# EAGLE schematic smps (EAGLE 7.3.0)
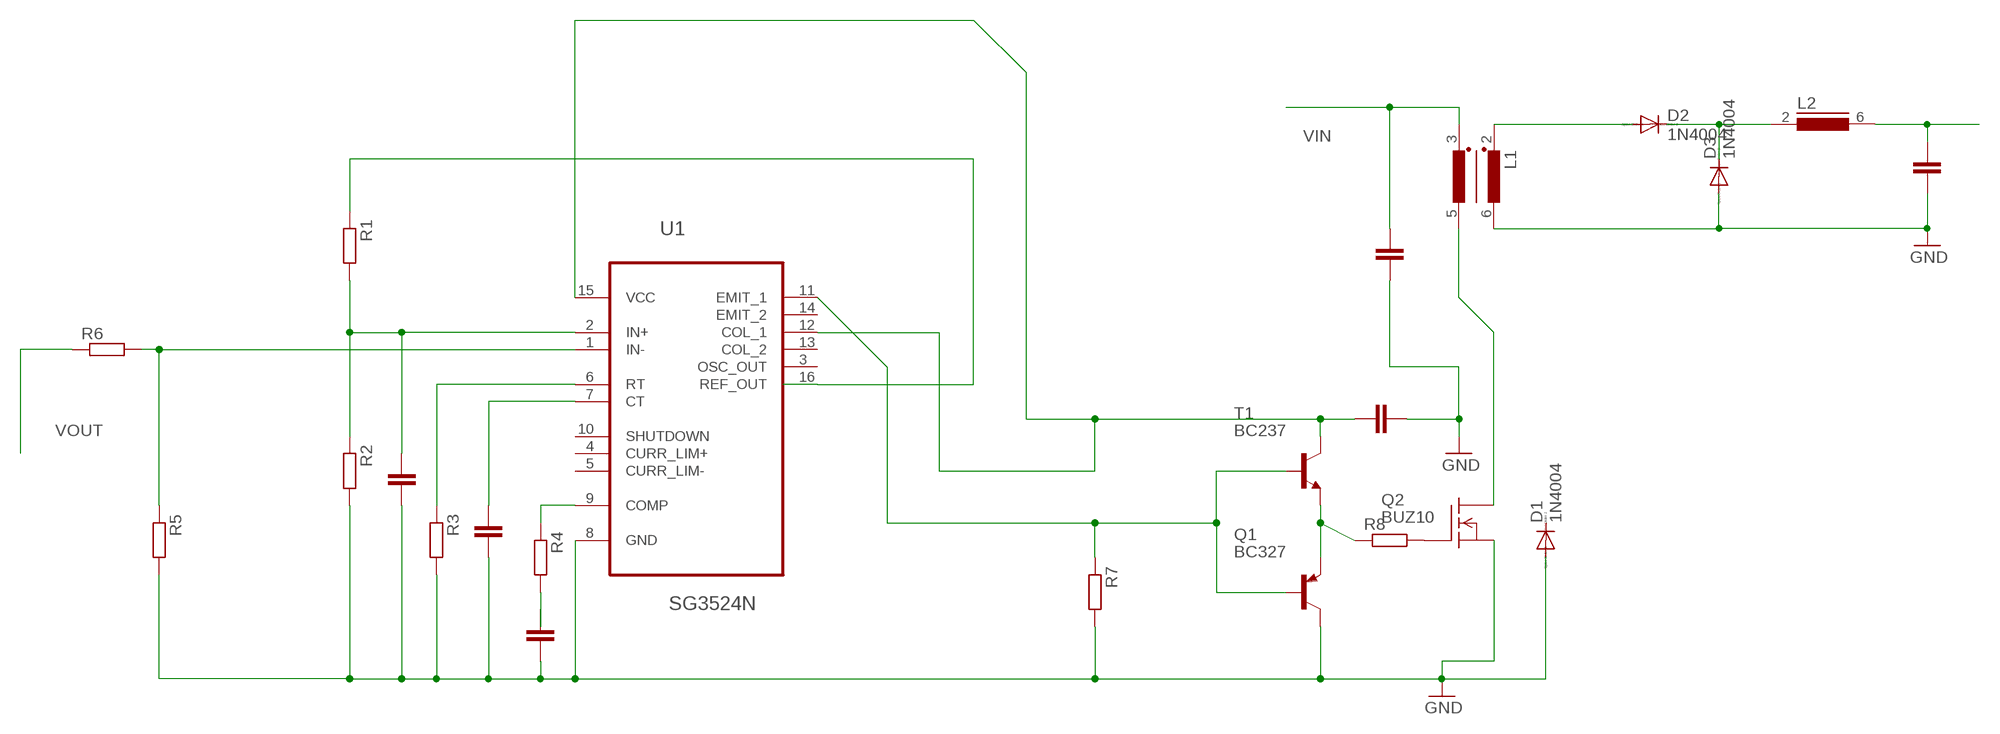
[diagram p0: schematic, sheet 1]

## Parts
D1  1N4004  [DO41-10]
D2  1N4004  [DO41-10]
D3  1N4004  [DO41-10]
L1  RM6-2  [RM5-4]
L2  RM6  [RM6-4]
Q1  BC327  [TO92]
Q2  BUZ10  [TO220]
R1  R-EU_0204/7  [0204/7]
R2  R-EU_0204/7  [0204/7]
R3  R-EU_0204/7  [0204/7]
R4  R-EU_0204/7  [0204/7]
R5  R-EU_0204/7  [0204/7]
R6  R-EU_0204/7  [0204/7]
R7  R-EU_0204/7  [0204/7]
R8  R-EU_0204/7  [0204/7]
T1  BC237  [TO92]
U1  SG3524N  [DIP254P762X508-16]

## Nets
GND: D1.A D3.A L1.6(W1E) Q1.3(C) Q2.3(S) R2.2 R3.2 R5.2 R7.2 U1.8(GND)
N$1: R1.1 U1.16(REF_OUT)
N$2: R1.2 R2.1 U1.2(IN+)
N$3: Q1.2(B) R7.1 T1.2(B) U1.11(EMIT_1)
N$4: T1.3(C) U1.12(COL_1) U1.15(VCC)
N$5: R3.1 U1.6(RT)
N$6: U1.7(CT)
N$7: R4.1 U1.9(COMP)
N$8: R4.2
N$9: R5.1 R6.2 U1.1(IN-)
N$10: Q1.1(E) R8.1 T1.1(E)
N$11: D2.A L1.2(W1A)
N$12: Q2.1(G) R8.2
N$13: D2.C D3.C L2.2
N$14: L1.5(W2E) Q2.2(D)
VIN: L1.3(W2A)
VOUT: L2.6 R6.1
Unconnected: D1.C U1.3(OSC_OUT) U1.4(CURR_LIM+) U1.5(CURR_LIM-) U1.10(SHUTDOWN) U1.13(COL_2) U1.14(EMIT_2)

## Library data of the parts
D1-D3 = diode:1N4004: DIODE general purpose rectifier, 1 A
L1 = trafo-siemens:RM6-2: TRANSFORMER; OC_FARNELL: unknown; OC_NEWARK: unknown
L2 = trafo-siemens:RM6: INDUCTOR; OC_FARNELL: unknown; OC_NEWARK: unknown
Q1 = transistor-pnp:BC327: PNP Transistor
Q2 = transistor-fet:BUZ10: N-Channel Enhancement MOSFET 50V; 20A; 0,080Ohm
R1-R8 = resistor:R-EU_: RESISTOR, European symbol
T1 = transistor:BC237: NPN TRANSISTOR
U1 = Texas Instruments_By_element14_Batch_1:SG3524N: REGULATING PULSE-WIDTH-MODULATORS; MPN: SG3524N; OC_FARNELL: 1094322; OC_NEWARK: 60K6778; PACKAGE: PDIP-16; SUPPLIER: Texas Instruments